# Altium schematic sheet AUPSC.SchDoc
size A4
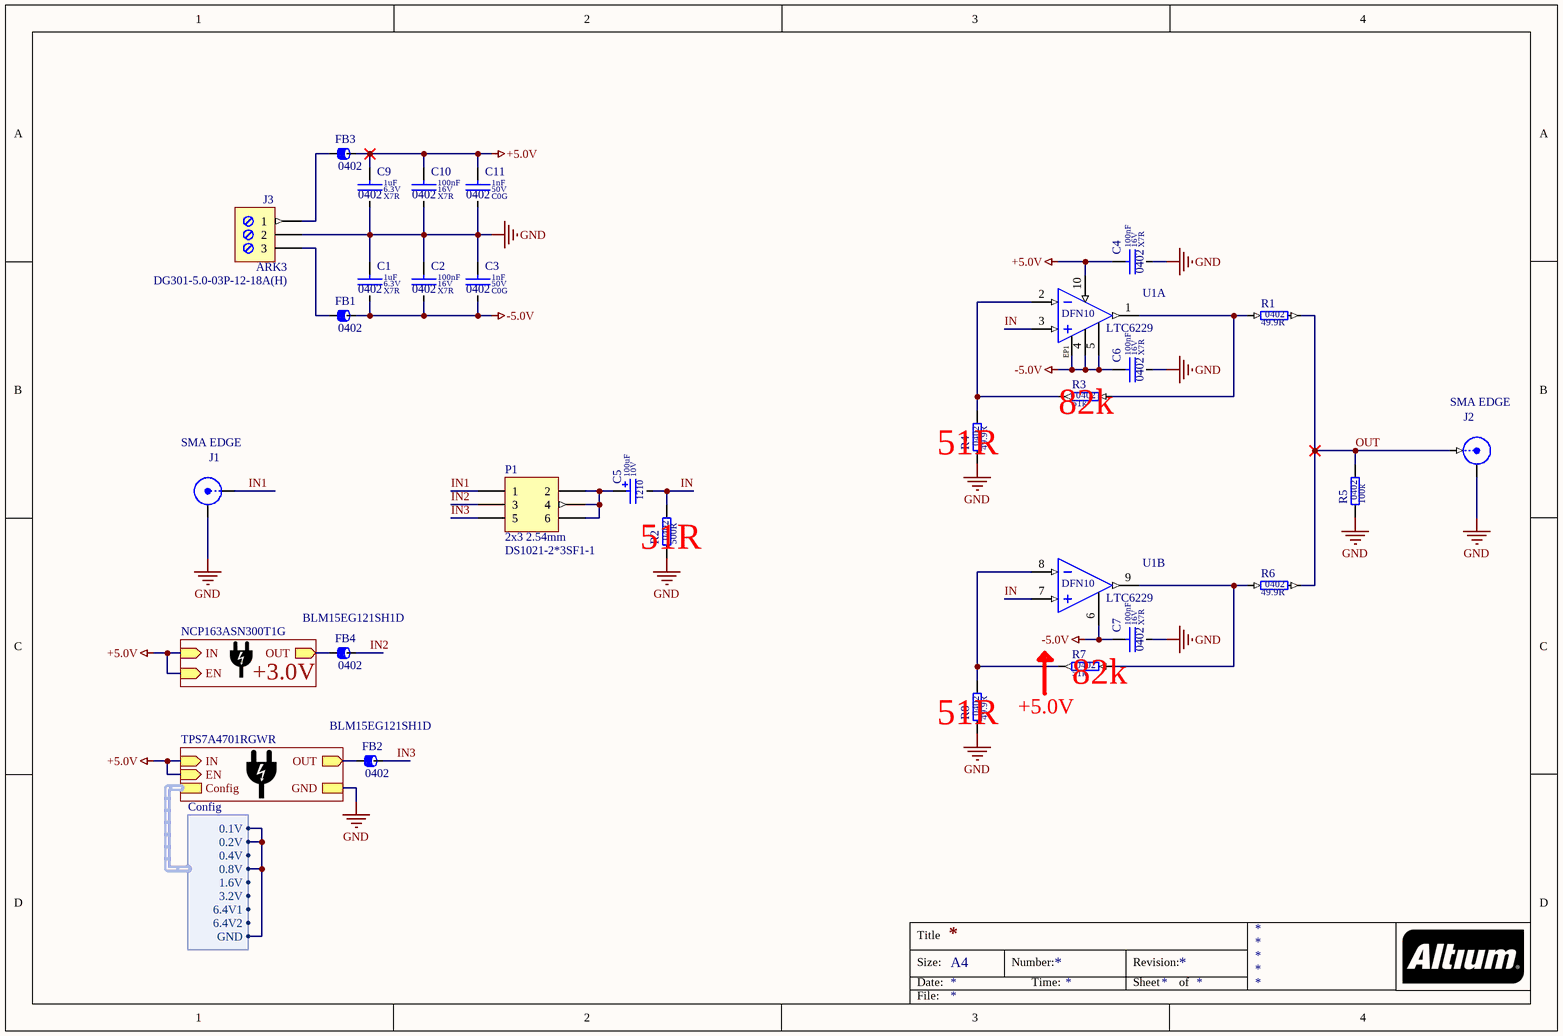
[diagram p0: AUPSC.SchDoc]

## Parts
C1  value 1uF  Dielectric: X7R  Voltage: 6.3V  SCH_Footprint: 0402  [C_0402_1005]  (hidden comment: Ceramic X7R)
C2  value 100nF  Dielectric: X7R  Voltage: 16V  SCH_Footprint: 0402  [C_0402_1005]  (hidden comment: Ceramic X7R)
C3  value 1nF  Dielectric: C0G  Voltage: 50V  SCH_Footprint: 0402  [C_0402_1005]  (hidden comment: Ceramic C0G)
C4  value 100nF  Dielectric: X7R  Voltage: 16V  SCH_Footprint: 0402  [C_0402_1005]  (hidden comment: Ceramic X7R)
C5  value 100uF  SCH_Footprint: 1210  Voltage: 10V  [CT_1210_3225]  (hidden comment: Tantalum Capacitor)
C6  value 100nF  Dielectric: X7R  Voltage: 16V  SCH_Footprint: 0402  [C_0402_1005]  (hidden comment: Ceramic X7R)
C7  value 100nF  Dielectric: X7R  Voltage: 16V  SCH_Footprint: 0402  [C_0402_1005]  (hidden comment: Ceramic X7R)
C9  value 1uF  Dielectric: X7R  Voltage: 6.3V  SCH_Footprint: 0402  [C_0402_1005]  (hidden comment: Ceramic X7R)
C10  value 100nF  Dielectric: X7R  Voltage: 16V  SCH_Footprint: 0402  [C_0402_1005]  (hidden comment: Ceramic X7R)
C11  value 1nF  Dielectric: C0G  Voltage: 50V  SCH_Footprint: 0402  [C_0402_1005]  (hidden comment: Ceramic C0G)
FB1  SCH_Footprint: 0402  [FB_0402_1005]  (hidden comment: Ferrite bead)
FB2  value BLM15EG121SH1D  SCH_Footprint: 0402  [FB_0402_1005]  (hidden comment: Ferrite bead)
FB3  SCH_Footprint: 0402  [FB_0402_1005]  (hidden comment: Ferrite bead)
FB4  value BLM15EG121SH1D  SCH_Footprint: 0402  [FB_0402_1005]  (hidden comment: Ferrite bead)
J1  SMA EDGE  [J_SMA_EDGE]
J2  SMA EDGE  [J_SMA_EDGE]
J3  value DG301-5.0-03P-12-18A(H)  [J_ARK3]  (hidden comment: ARK3)
P1  value DS1021-2*3SF1-1  SCH_Footprint: 2x3 2.54mm  [P_HEADER_2x3_2.54]  (hidden comment: Goldpin male)
R1  value 49.9R  SCH_Footprint: 0402  [R_0402_1005]  (hidden comment: Resistor)
R2  value 500R  SCH_Footprint: 0402  [R_0402_1005]  (hidden comment: Resistor)
R3  value 51k  SCH_Footprint: 0402  [R_0402_1005]  (hidden comment: Resistor)
R4  value 49.9R  SCH_Footprint: 0402  [R_0402_1005]  (hidden comment: Resistor)
R5  value 100k  SCH_Footprint: 0402  [R_0402_1005]  (hidden comment: Resistor)
R6  value 49.9R  SCH_Footprint: 0402  [R_0402_1005]  (hidden comment: Resistor)
R7  value 51k  SCH_Footprint: 0402  [R_0402_1005]  (hidden comment: Resistor)
R8  value 49.9R  SCH_Footprint: 0402  [R_0402_1005]  (hidden comment: Resistor)
U1  value LTC6229  SCH_Footprint: DFN10  [DFN10_3x3_EP]  (hidden comment: ADA4807-2ACPZ)  (parts A,B of 2)

## Sub-sheets
U_NCP163ASN300T1G = NCP163ASN300T1G: EN (in), IN (in), OUT (out)
U_TPS7A4701RGWR = TPS7A4701RGWR: IN (in), EN (in), Config (harness Config), OUT (out), GND

## Harnesses
Config: 0.1V, 0.2V, 0.4V, 0.8V, 1.6V, 3.2V, 6.4V1, 6.4V2, GND

## Nets
+5.0V: C4.1 C9.1 C10.1 C11.1 FB3.2 U1.10(VDD) ; sheet U_TPS7A4701RGWR/IN, sheet U_TPS7A4701RGWR/EN, sheet U_NCP163ASN300T1G/EN, sheet U_NCP163ASN300T1G/IN
-5.0V: C1.2 C2.2 C3.2 C6.1 C7.1 FB1.2 U1.4(GND) U1.5(~{SHNDA}) U1.6(~{SHNDB}) U1.EP1(GND)
GND: C1.1 C2.1 C3.1 C4.2 C6.2 C7.2 C9.2 C10.2 C11.2 J1.2(GND) J2.2(GND) J3.2 R2.1 R4.1 R5.1 R8.1 ; sheet U_TPS7A4701RGWR/GND
IN: C5.2 R2.2 U1.3(IN+) U1.7(IN+)
IN1: J1.1(X) P1.1
IN2: FB4.2 P1.3
IN3: FB2.2 P1.5
OUT: J2.1(X) R1.2 R5.2 R6.2
NetC5_1: C5.1 P1.2 P1.4 P1.6
NetFB1_1: FB1.1 J3.3
NetFB2_1: FB2.1 ; sheet U_TPS7A4701RGWR/OUT
NetFB3_1: FB3.1 J3.1
NetFB4_1: FB4.1 ; sheet U_NCP163ASN300T1G/OUT
NetR1_1: R1.1 R3.2 U1.1(OUT)
NetR3_1: R3.1 R4.2 U1.2(IN-)
NetR6_1: R6.1 R7.2 U1.9(OUT)
NetR7_1: R7.1 R8.2 U1.8(IN-)
(unnamed): sheet U_TPS7A4701RGWR/Config.0.1V, sheet U_TPS7A4701RGWR/Config.0.2V, sheet U_TPS7A4701RGWR/Config.0.8V, sheet U_TPS7A4701RGWR/Config.GND

## Notes on the sheet
- (near R3) 82k
- (near R4) 51R
- (near R2) 51R
- (near FB4) +3.0V
- +5.0V
- (near R7) 82k
- (near R8) 51R
- Title
- Size:
- Date:
- A4
- Number:
- Time:
- Revision:
- Sheet
- of
- File:

## Library data of the parts
C1 C9 = C_1uF_6.3V_X7R_0402_10: Capacitor; Manufacturer: Murata; Manufacturer Part Number: GRM155R70J105KA12D; Tolerance (%): 10; Part Number: C_1uF_6.3V_X7R_0402_10; HelpURL: https://www.mouser.com/ds/2/281/c02e-2905.pdf; Supplier 1: TME; Supplier 2: RS Components; Supplier 3: Farnell; Supplier 4: Mouser; Supplier Part Number 4: 81-GRM155R70J105KA2D; Supplier 5: Digi-Key
C2 C4 C6 C7 C10 = C_100nF_16V_X7R_0402_10: Capacitor; Manufacturer: Murata; Manufacturer Part Number: GRM155R71C104KA88D; Tolerance (%): 10; Part Number: C_100nF_16V_X7R_0402_10; HelpURL: https://www.mouser.com/ds/2/281/c02e-2905.pdf; Supplier 1: TME; Supplier 2: RS Components; Supplier 3: Farnell; Supplier 4: Mouser; Supplier Part Number 4: 81-GRM155R71C104KA88; Supplier 5: Digi-Key
C3 C11 = C_1nF_50V_C0G_0402_5: Capacitor; Manufacturer: Murata; Manufacturer Part Number: GRM1555C1H102JA01D; Tolerance (%): 5; Part Number: C_1nF_50V_C0G_0402_5; HelpURL: http://www.tme.eu/en/Document/e3e731e59cc68b1ab6d46b158bb05733/MURATA_GRM.pdf; Supplier 1: TME; Supplier Part Number 1: GRM1555C1H102JA01D; Supplier 2: RS Components; Supplier Part Number 2: 6242913; Supplier 3: Farnell; Supplier Part Number 3: 2408520; Supplier 4: Mouser; Supplier Part Number 4: 81-GRM1555C1H102JA1D; Supplier 5: Digi-Key; Supplier Part Number 5: 490-3244-1-ND
C5 = CT_100uF_10V_TA2O5_1210_20: Capacitor; Manufacturer: AVX; Manufacturer Part Number: TAJB107M010RNJ; Dielectric: TA2O5; Tolerance (%): 20; Part Number: CT_100uF_10V_TA2O5_1210_20; HelpURL: https://datasheet.octopart.com/TAJB107M010RNJ-AVX-datasheet-12511273.pdf; Supplier 1: TME; Supplier Part Number 1: TAJB107M010R; Supplier 2: RS Components; Supplier Part Number 2: 1360118; Supplier 3: Farnell; Supplier Part Number 3: 1658150; Supplier 4: Mouser; Supplier Part Number 4: 581-TAJB107M010R; Supplier 5: Digi-Key; Supplier Part Number 5: 478-5801-1-ND; Supplier 6: LCSC
FB1-FB4 = FB_BLM15EG121SH1D: Manufacturer: Murata; Current: 1.5A; Resistance: 95mR; Part Number: FB_BLM15EG121SH1D; HelpURL: http://datasheet.octopart.com/BLM15EG121SH1D-Murata-datasheet-37129980.pdf; Manufacturer Part Number: BLM15EG121SH1D; Supplier 1: TME; Supplier 2: RS Components; Supplier 3: Farnell; Supplier Part Number 3: 2871614; Supplier 4: Mouser; Supplier Part Number 4: 81-BLM15EG121SH1D; Supplier 5: Digi-Key; Supplier Part Number 5: 490-17344-1-ND; Supplier 6: LCSC
J1 J2 = J_SMA_EDGE_UNIVERSAL: SMA connector; Part Number: J_SMA_EDGE_UNIVERSAL; SCH_Footprint: SMA EDGE; Supplier 1: TME; Supplier 2: RS Components; Supplier 3: Farnell; Supplier 4: Mouser; Supplier 5: Digi-Key; Supplier 6: LCSC
J3 = J_TB-5.0-P-3P: ARK Screw terminal, 3-Pin; Manufacturer: DEGSON ELECTRONICS; SCH_Footprint: ARK3; Part Number: J_TB-5.0-P-3P; HelpURL: https://datasheet.octopart.com/DG301-5.0-03P-12-18A%28H%29-Degson-datasheet-17801202.pdf; Manufacturer Part Number: DG301-5.0-03P-12-18A(H); Supplier 1: TME; Supplier Part Number 1: DG301-5.0-3/6B; Supplier 2: RS Components; Supplier 3: Farnell; Supplier 4: Mouser; Supplier 5: Digi-Key; Supplier 6: LCSC
P1 = P_HEADER_2x3_2.54: Pin Header; Manufacturer: Connfly; Part Number: P_HEADER_2x3_2.54; HelpURL: https://www.tme.eu/Document/cc301e58a5da78cb543a94b5a5b7f06a/DS1021.pdf; Manufacturer Part Number: DS1021-2*3SF1-1; Supplier 1: TME; Supplier Part Number 1: ZL202-6G; Supplier 2: RS Components; Supplier 3: Farnell; Supplier 4: Mouser; Supplier 5: Digi-Key; Supplier 6: LCSC
R1 R4 R6 R8 = R_49.9R_0402_1: Manufacturer: Panasonic; Manufacturer Part Number: ERJ-2RKF49R9X; Voltage: 50V; Power: 100mW; Tolerance: 1%; Part Number: R_49.9R_0402_1; HelpURL: https://datasheet.octopart.com/ERJ-2RKF49R9X-Panasonic-datasheet-13266541.pdf; Supplier 1: TME; Supplier 2: RS Components; Supplier Part Number 2: 812-6611; Supplier 3: Farnell; Supplier Part Number 3: 2059109; Supplier 4: Mouser; Supplier Part Number 4: 667-ERJ-2RKF49R9X; Supplier 5: Digi-Key; Supplier Part Number 5: P49.9LCT-ND; Supplier 6: LCSC
R2 = R_500R_0402_0.1: Manufacturer: Vishay; Manufacturer Part Number: PNM0402E5000BST1; Voltage: 75V; Power: 50mW; Tolerance: 0.1%; Part Number: R_500R_0402_0.1; HelpURL: https://www.vishay.com/docs/60057/pnm.pdf; Supplier 1: TME; Supplier 2: RS Components; Supplier 3: Farnell; Supplier 4: Mouser; Supplier Part Number 4: 71-PNM0402E5000BST1; Supplier 5: Digi-Key; Supplier Part Number 5: 541-1905-1-ND; Supplier 6: LCSC; Supplier 7: Arrow Electronics; Supplier Part Number 7: PNM0402E5000BST1
R3 R7 = R_51k_0402_1: Manufacturer: Multicomp; Manufacturer Part Number: MCWR04X5102FTL; Voltage: 50V; Power: 62.5mW; Tolerance: 1%; Part Number: R_51k_0402_1; HelpURL: http://www.farnell.com/datasheets/2563624.pdf?_ga=2.118585673.1757361746.1541820464-179212882.1536072512; Supplier 1: TME; Supplier 2: RS Components; Supplier 3: Farnell; Supplier Part Number 3: 2447195; Supplier 4: Mouser; Supplier 5: Digi-Key; Supplier 6: LCSC
R5 = R_100k_0402_1: Manufacturer: Yageo; Manufacturer Part Number: RC0402FR-07100KL; Voltage: 50V; Power: 63mW; Tolerance: 1%; Part Number: R_100k_0402_1; HelpURL: http://www.tme.eu/pl/Document/1a2bc76e2be68b3b1670068306778ce6/rc0402yageo.pdf; Supplier 1: TME; Supplier Part Number 1: RC0402FR-07100K; Supplier 2: RS Components; Supplier 3: Farnell; Supplier Part Number 3: 2131798; Supplier 4: Mouser; Supplier Part Number 4: 603-RC0402FR-07100KL; Supplier 5: Digi-Key; Supplier Part Number 5: 311-100KLRCT-ND; Supplier 6: LCSC
U1 = U_ADA4807-2ACPZ-R2: Manufacturer: Analog Devices; Part Number: U_ADA4807-2ACPZ-R2; HelpURL: https://datasheet.octopart.com/ADA4807-2ACPZ-R2-Analog-Devices-datasheet-41922906.pdf; Manufacturer Part Number: ADA4807-2ACPZ-R2; Supplier 1: TME; Supplier 2: RS Components; Supplier Part Number 2: 8930435; Supplier 3: Farnell; Supplier Part Number 3: 2490570; Supplier 4: Mouser; Supplier Part Number 4: 584-ADA4807-2ACPZ-R2; Supplier 5: Digi-Key; Supplier Part Number 5: ADA4807-2ACPZ-R2CT-ND; Supplier 6: LCSC